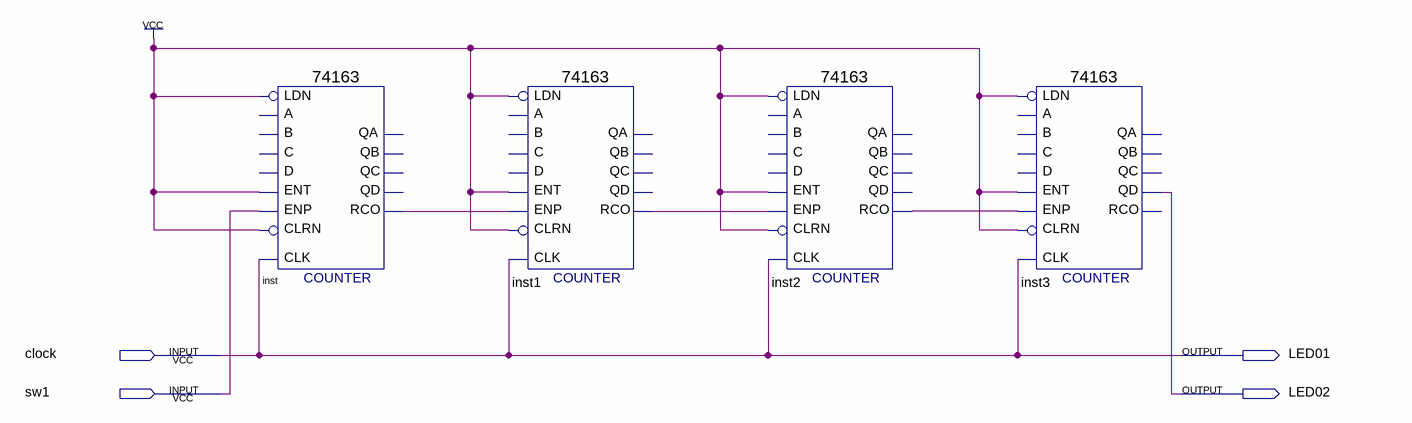
[diagram p0: schematic sheet]
// Quartus schematic oscillo_test.bdf as structural Verilog: 4 symbols, 4 pins
module oscillo_test (
  input  clock,
  input  sw1,
  output LED01,
  output LED02
);

  wire inst1_rco, inst2_rco, inst_rco;

  \74163  inst (
    .ENT(1'b1), .CLRN(1'b1), .CLK(clock), .ENP(sw1), .LDN(1'b1), .RCO(inst_rco));  // open: C, B, A, D, QA, QB, QC, QD
  \74163  inst1 (
    .ENT(1'b1), .CLRN(1'b1), .CLK(clock), .ENP(inst_rco), .LDN(1'b1), .RCO(inst1_rco));  // open: C, B, A, D, QA, QB, QC, QD
  \74163  inst2 (
    .ENT(1'b1), .CLRN(1'b1), .CLK(clock), .ENP(inst1_rco), .LDN(1'b1), .RCO(inst2_rco));  // open: C, B, A, D, QA, QB, QC, QD
  \74163  inst3 (
    .ENT(1'b1), .CLRN(1'b1), .CLK(clock), .ENP(inst2_rco), .LDN(1'b1), .QD(LED02));  // open: C, B, A, D, QA, QB, QC, RCO

  assign LED01 = clock;
endmodule
